# EAGLE design Laser7Clock (EAGLE 9.2.2)
COMPANY: UnexpectedMaker; DATE: Jan 14 2019; DRAWN: Seon; REV: 4; TITLE: LaserWifiClock

## Sheet 1 of 2
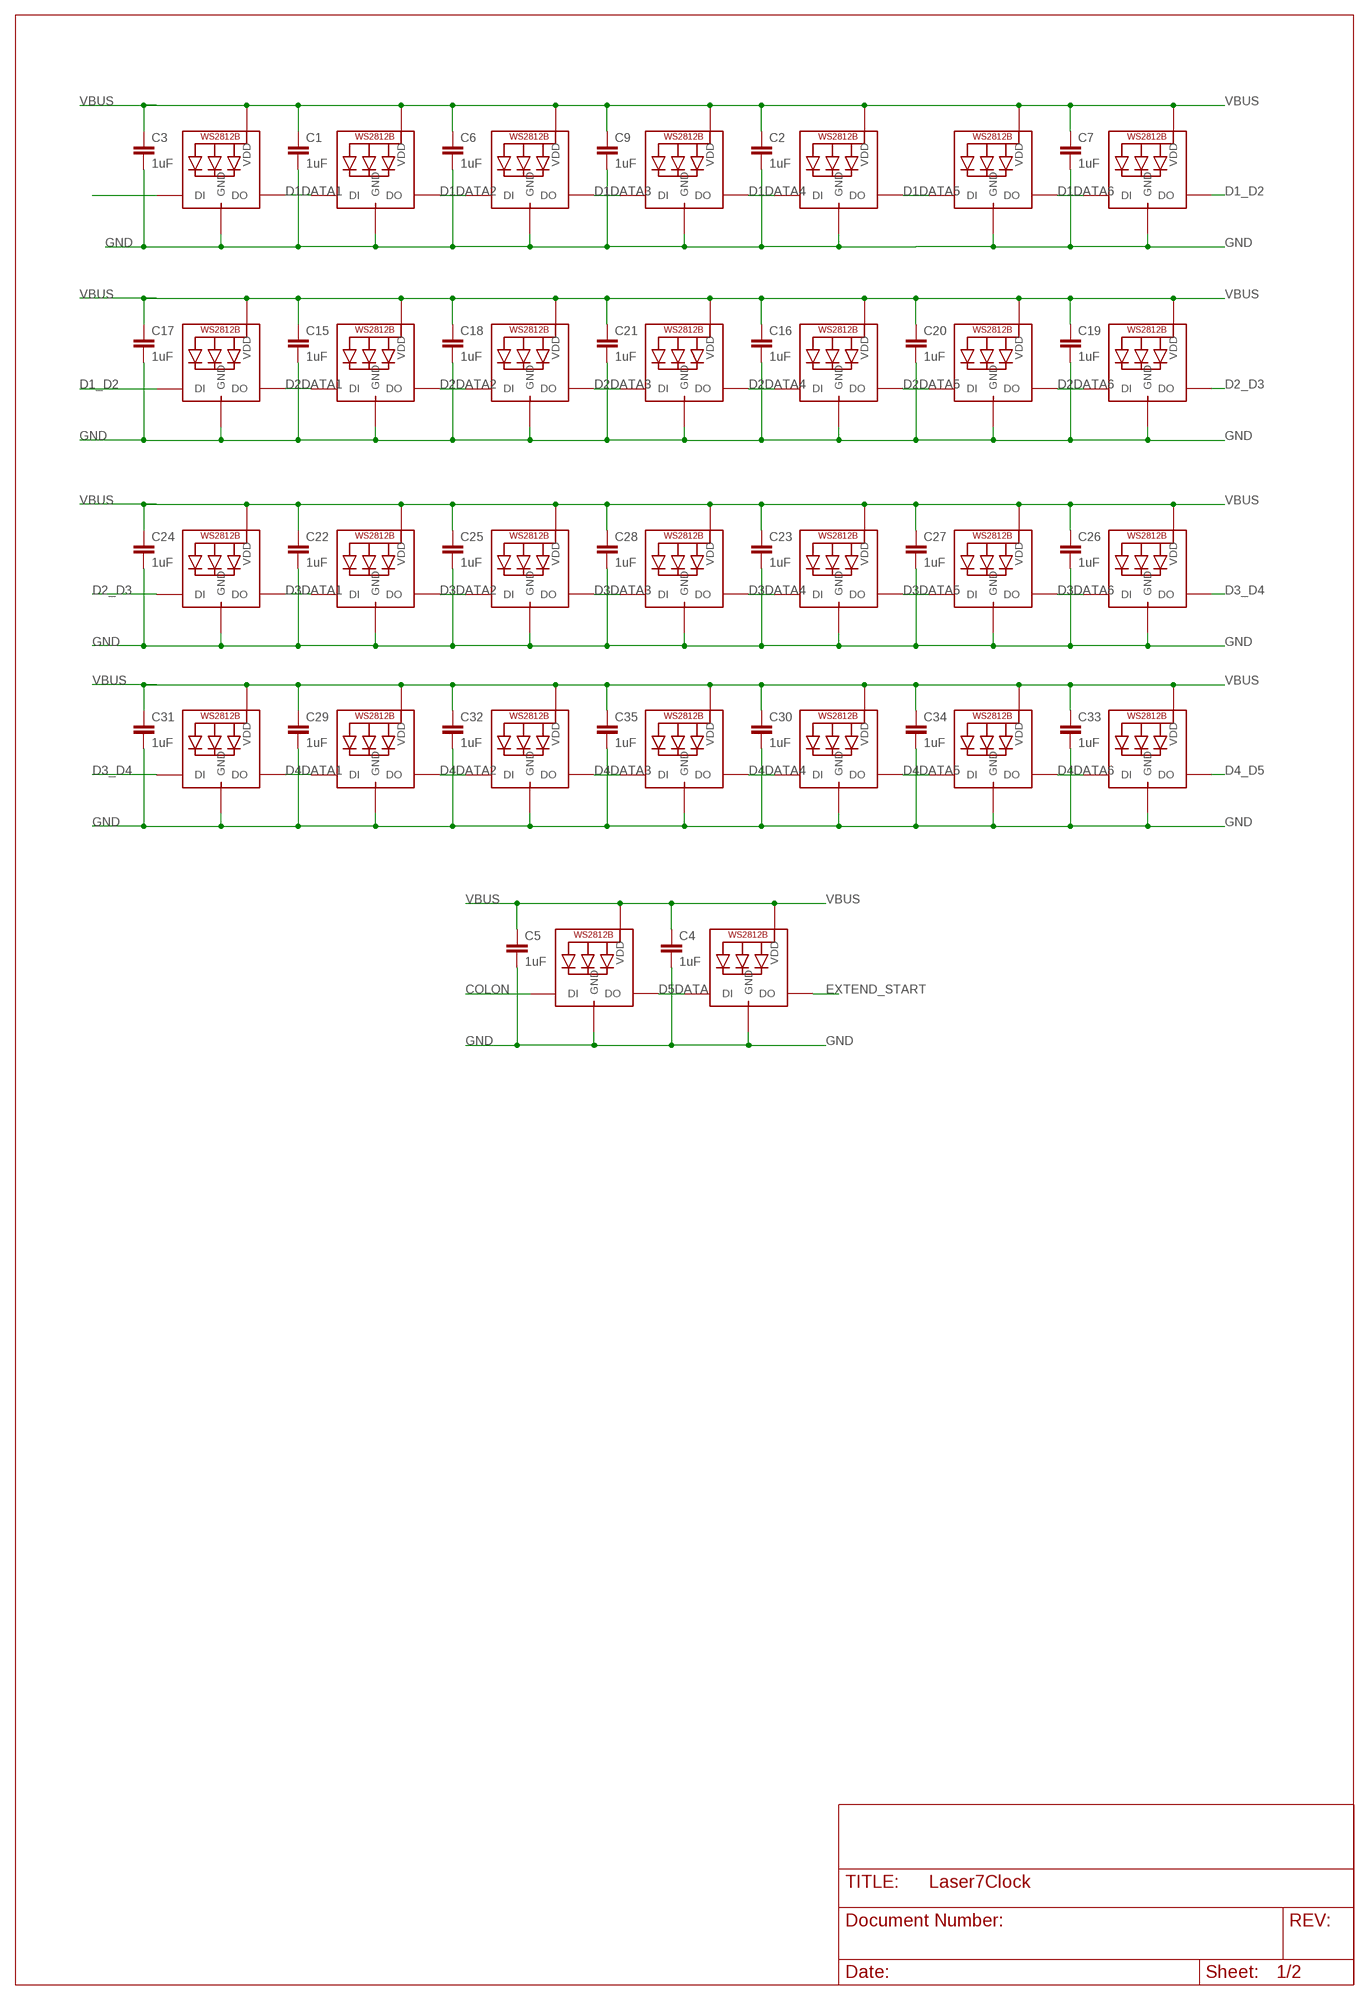
[diagram p0: schematic, sheet 1]

### Parts
C1  1uF  C-EUC0805K  [C0805K]
C2  1uF  C-EUC0805K  [C0805K]
C3  1uF  C-EUC0805K  [C0805K]
C4  1uF  C-EUC0805K  [C0805K]
C5  1uF  C-EUC0805K  [C0805K]
C6  1uF  C-EUC0805K  [C0805K]
C7  1uF  C-EUC0805K  [C0805K]
C9  1uF  C-EUC0805K  [C0805K]
C15  1uF  C-EUC0805K  [C0805K]
C16  1uF  C-EUC0805K  [C0805K]
C17  1uF  C-EUC0805K  [C0805K]
C18  1uF  C-EUC0805K  [C0805K]
C19  1uF  C-EUC0805K  [C0805K]
C20  1uF  C-EUC0805K  [C0805K]
C21  1uF  C-EUC0805K  [C0805K]
C22  1uF  C-EUC0805K  [C0805K]
C23  1uF  C-EUC0805K  [C0805K]
C24  1uF  C-EUC0805K  [C0805K]
C25  1uF  C-EUC0805K  [C0805K]
C26  1uF  C-EUC0805K  [C0805K]
C27  1uF  C-EUC0805K  [C0805K]
C28  1uF  C-EUC0805K  [C0805K]
C29  1uF  C-EUC0805K  [C0805K]
C30  1uF  C-EUC0805K  [C0805K]
C31  1uF  C-EUC0805K  [C0805K]
C32  1uF  C-EUC0805K  [C0805K]
C33  1uF  C-EUC0805K  [C0805K]
C34  1uF  C-EUC0805K  [C0805K]
C35  1uF  C-EUC0805K  [C0805K]
D1L1  WS2812B5050  [WS2812B]
D1L2  WS2812B5050  [WS2812B]
D1L3  WS2812B5050  [WS2812B]
D1L4  WS2812B5050  [WS2812B]
D1L5  WS2812B5050  [WS2812B]
D1L6  WS2812B5050  [WS2812B]
D1L7  WS2812B5050  [WS2812B]
D2L1  WS2812B5050  [WS2812B]
D2L2  WS2812B5050  [WS2812B]
D2L3  WS2812B5050  [WS2812B]
D2L4  WS2812B5050  [WS2812B]
D2L5  WS2812B5050  [WS2812B]
D2L6  WS2812B5050  [WS2812B]
D2L7  WS2812B5050  [WS2812B]
D3L1  WS2812B5050  [WS2812B]
D3L2  WS2812B5050  [WS2812B]
D3L3  WS2812B5050  [WS2812B]
D3L4  WS2812B5050  [WS2812B]
D3L5  WS2812B5050  [WS2812B]
D3L6  WS2812B5050  [WS2812B]
D3L7  WS2812B5050  [WS2812B]
D4L1  WS2812B5050  [WS2812B]
D4L2  WS2812B5050  [WS2812B]
D4L3  WS2812B5050  [WS2812B]
D4L4  WS2812B5050  [WS2812B]
D4L5  WS2812B5050  [WS2812B]
D4L6  WS2812B5050  [WS2812B]
D4L7  WS2812B5050  [WS2812B]
LED1  WS2812B5050  [WS2812B]
LED2  WS2812B5050  [WS2812B]

### Nets
COLON: LED1.4-DIN(DI) ; also sheet 2
D1_D2: D1L7.2-DOUT(DO) D2L1.4-DIN(DI)
D1DATA1: D1L1.2-DOUT(DO) D1L2.4-DIN(DI)
D1DATA2: D1L2.2-DOUT(DO) D1L3.4-DIN(DI)
D1DATA3: D1L3.2-DOUT(DO) D1L4.4-DIN(DI)
D1DATA4: D1L4.2-DOUT(DO) D1L5.4-DIN(DI)
D1DATA5: D1L5.2-DOUT(DO) D1L6.4-DIN(DI)
D1DATA6: D1L6.2-DOUT(DO) D1L7.4-DIN(DI)
D2_D3: D2L7.2-DOUT(DO) D3L1.4-DIN(DI)
D2DATA1: D2L1.2-DOUT(DO) D2L2.4-DIN(DI)
D2DATA2: D2L2.2-DOUT(DO) D2L3.4-DIN(DI)
D2DATA3: D2L3.2-DOUT(DO) D2L4.4-DIN(DI)
D2DATA4: D2L4.2-DOUT(DO) D2L5.4-DIN(DI)
D2DATA5: D2L5.2-DOUT(DO) D2L6.4-DIN(DI)
D2DATA6: D2L6.2-DOUT(DO) D2L7.4-DIN(DI)
D3_D4: D3L7.2-DOUT(DO) D4L1.4-DIN(DI)
D3DATA1: D3L1.2-DOUT(DO) D3L2.4-DIN(DI)
D3DATA2: D3L2.2-DOUT(DO) D3L3.4-DIN(DI)
D3DATA3: D3L3.2-DOUT(DO) D3L4.4-DIN(DI)
D3DATA4: D3L4.2-DOUT(DO) D3L5.4-DIN(DI)
D3DATA5: D3L5.2-DOUT(DO) D3L6.4-DIN(DI)
D3DATA6: D3L6.2-DOUT(DO) D3L7.4-DIN(DI)
D4_D5: D4L7.2-DOUT(DO) ; also sheet 2
D4DATA1: D4L1.2-DOUT(DO) D4L2.4-DIN(DI)
D4DATA2: D4L2.2-DOUT(DO) D4L3.4-DIN(DI)
D4DATA3: D4L3.2-DOUT(DO) D4L4.4-DIN(DI)
D4DATA4: D4L4.2-DOUT(DO) D4L5.4-DIN(DI)
D4DATA5: D4L5.2-DOUT(DO) D4L6.4-DIN(DI)
D4DATA6: D4L6.2-DOUT(DO) D4L7.4-DIN(DI)
D5DATA: LED1.2-DOUT(DO) LED2.4-DIN(DI)
DI_R: D1L1.4-DIN(DI) ; also sheet 2
EXTEND_START: LED2.2-DOUT(DO) ; also sheet 2
GND: C1.2 C2.2 C3.2 C4.2 C5.2 C6.2 C7.2 C9.2 C15.2 C16.2 C17.2 C18.2 C19.2 C20.2 C21.2 C22.2 C23.2 C24.2 C25.2 C26.2 C27.2 C28.2 C29.2 C30.2 C31.2 C32.2 C33.2 C34.2 C35.2 D1L1.3-GND(GND) D1L2.3-GND(GND) D1L3.3-GND(GND) D1L4.3-GND(GND) D1L5.3-GND(GND) D1L6.3-GND(GND) D1L7.3-GND(GND) D2L1.3-GND(GND) D2L2.3-GND(GND) D2L3.3-GND(GND) D2L4.3-GND(GND) D2L5.3-GND(GND) D2L6.3-GND(GND) D2L7.3-GND(GND) D3L1.3-GND(GND) D3L2.3-GND(GND) D3L3.3-GND(GND) D3L4.3-GND(GND) D3L5.3-GND(GND) D3L6.3-GND(GND) D3L7.3-GND(GND) D4L1.3-GND(GND) D4L2.3-GND(GND) D4L3.3-GND(GND) D4L4.3-GND(GND) D4L5.3-GND(GND) D4L6.3-GND(GND) D4L7.3-GND(GND) LED1.3-GND(GND) LED2.3-GND(GND) ; also sheet 2
VBUS: C1.1 C2.1 C3.1 C4.1 C5.1 C6.1 C7.1 C9.1 C15.1 C16.1 C17.1 C18.1 C19.1 C20.1 C21.1 C22.1 C23.1 C24.1 C25.1 C26.1 C27.1 C28.1 C29.1 C30.1 C31.1 C32.1 C33.1 C34.1 C35.1 D1L1.1-VDD(VDD) D1L2.1-VDD(VDD) D1L3.1-VDD(VDD) D1L4.1-VDD(VDD) D1L5.1-VDD(VDD) D1L6.1-VDD(VDD) D1L7.1-VDD(VDD) D2L1.1-VDD(VDD) D2L2.1-VDD(VDD) D2L3.1-VDD(VDD) D2L4.1-VDD(VDD) D2L5.1-VDD(VDD) D2L6.1-VDD(VDD) D2L7.1-VDD(VDD) D3L1.1-VDD(VDD) D3L2.1-VDD(VDD) D3L3.1-VDD(VDD) D3L4.1-VDD(VDD) D3L5.1-VDD(VDD) D3L6.1-VDD(VDD) D3L7.1-VDD(VDD) D4L1.1-VDD(VDD) D4L2.1-VDD(VDD) D4L3.1-VDD(VDD) D4L4.1-VDD(VDD) D4L5.1-VDD(VDD) D4L6.1-VDD(VDD) D4L7.1-VDD(VDD) LED1.1-VDD(VDD) LED2.1-VDD(VDD) ; also sheet 2

## Sheet 2 of 2
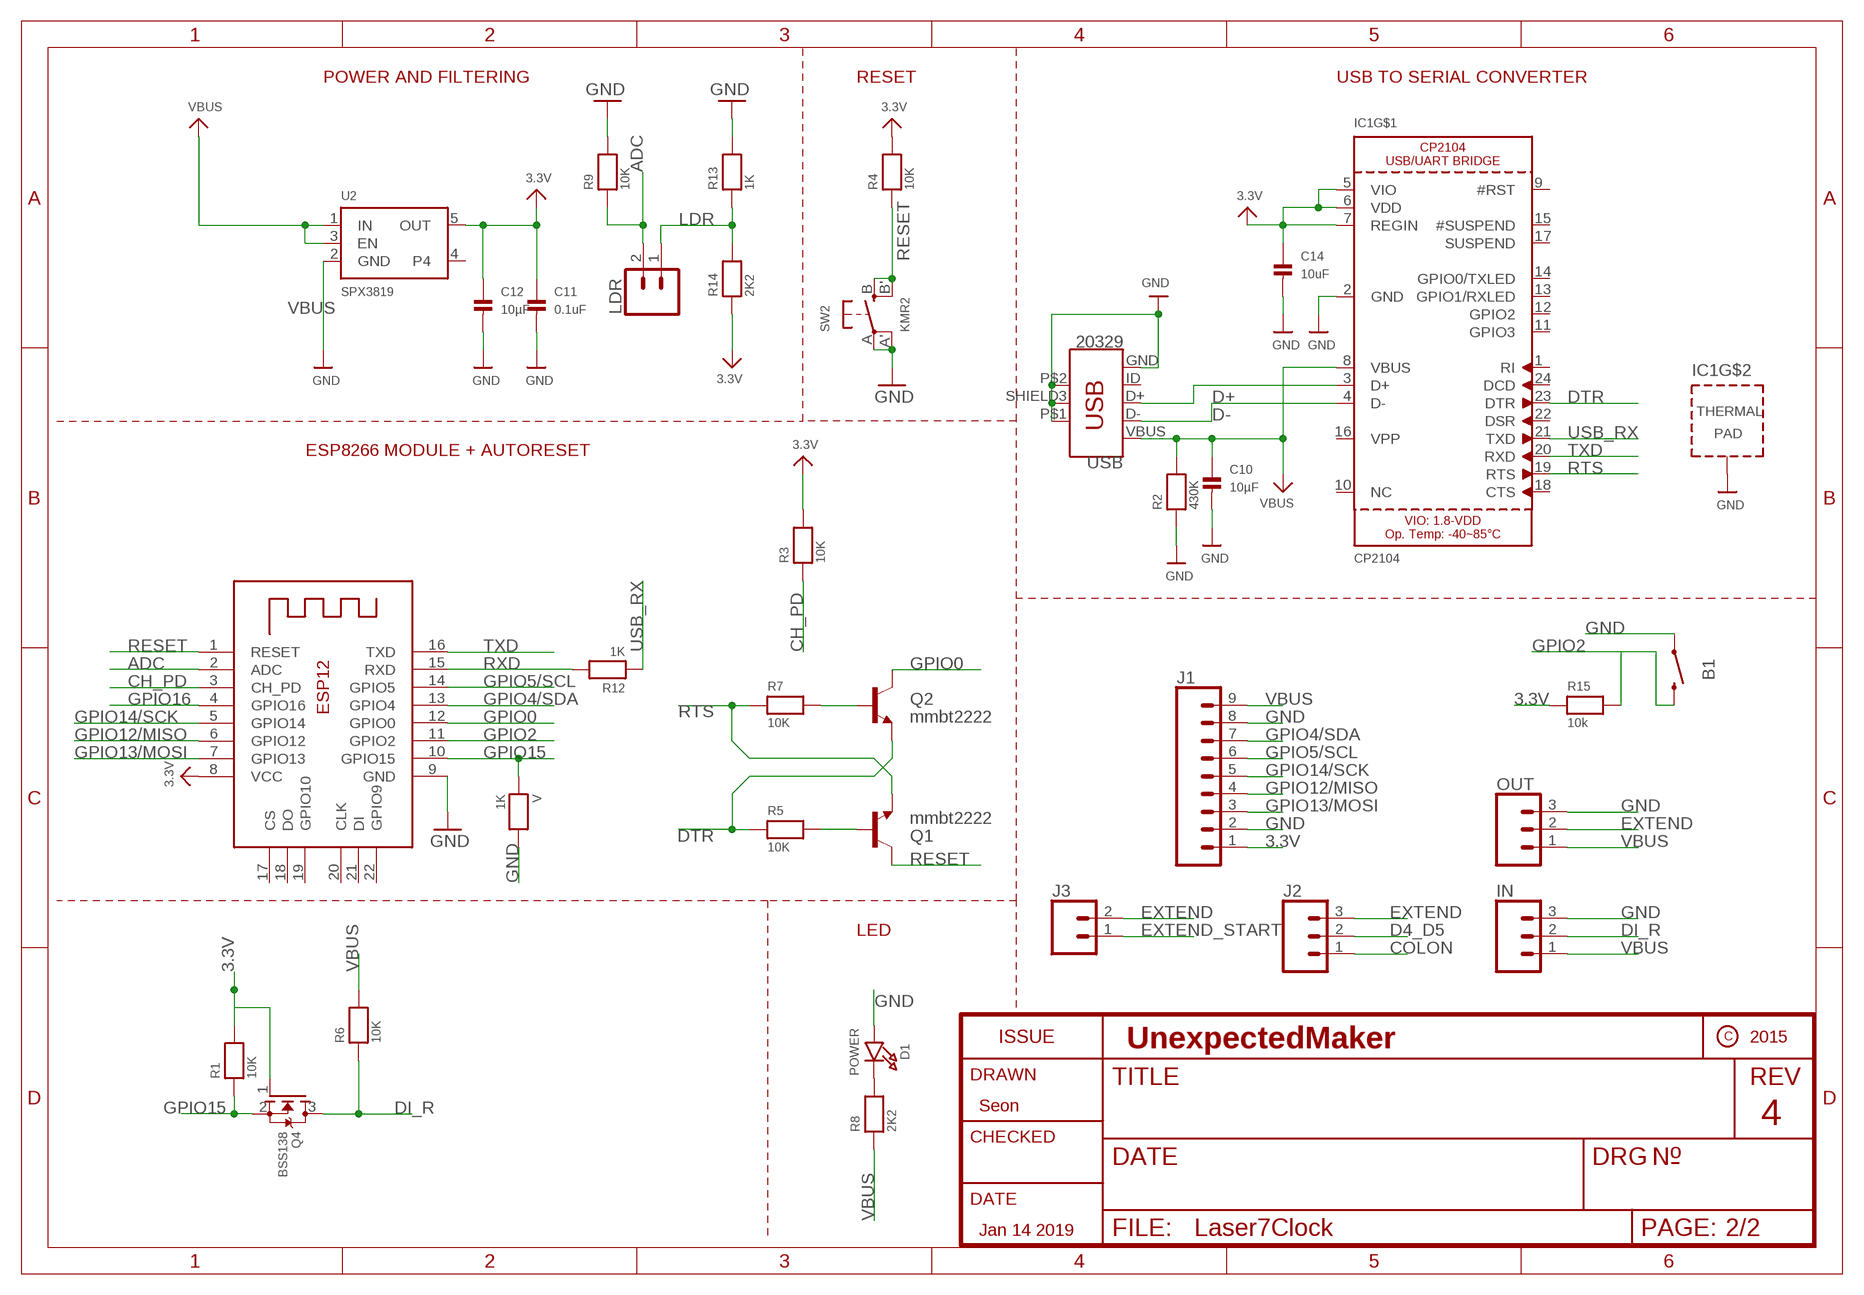
[diagram p1: schematic, sheet 2]

### Parts
B1  MOMENTARY-SWITCH-SPST-PTH-RIGHT-ANGLE-KIT  [TACTILE_SWITCH_PTH_RIGHT_ANGLE_KIT]
C10  10µF  CAP_CERAMIC_0805MP  [_0805MP]
C11  0.1uF  CAP_CERAMIC_0805MP  [_0805MP]
C12  10µF  CAP_CERAMIC_0805MP  [_0805MP]
C14  10uF  CAP_CERAMIC_0805MP  [_0805MP]
D1  POWER  LED0805_NOOUTLINE  [CHIPLED_0805_NOOUTLINE]
IC1  CP2104  [QFN24_4MM_SMSC]
IN  CONN_03LONGPADS  [1X03_LONGPADS]
J1  CONN_09NO_SILK  [1X09_NO_SILK]
J2  CONN_031X03_NO_SILK  [1X03_NO_SILK]
J3  CONN_021X02_NO_SILK  [1X02_NO_SILK]
LDR  CONN_021X02_NO_SILK  [1X02_NO_SILK]
OUT  CONN_03LONGPADS  [1X03_LONGPADS]
Q1  mmbt2222  TRANSISTOR_NPNSOT23-3  [SOT23-3]
Q2  mmbt2222  TRANSISTOR_NPNSOT23-3  [SOT23-3]
Q4  BSS138  MOSFET-NREFLOW  [SOT23-R]
R1  10K  RESISTOR_0603MP  [_0603MP]
R2  430K  RESISTOR_0805MP  [_0805MP]
R3  10K  RESISTOR_0603MP  [_0603MP]
R4  10K  RESISTOR_0603MP  [_0603MP]
R5  10K  RESISTOR_0603MP  [_0603MP]
R6  10K  RESISTOR_0603MP  [_0603MP]
R7  10K  RESISTOR_0603MP  [_0603MP]
R8  2K2  RESISTOR_0805MP  [_0805MP]
R9  10K  RESISTOR_0805MP  [_0805MP]
R12  1K  RESISTOR_0603MP  [_0603MP]
R13  1K  RESISTOR_0805MP  [_0805MP]
R14  2K2  RESISTOR_0805MP  [_0805MP]
R15  10k  RESISTOR_0603MP  [_0603MP]
SW2  KMR2  SWITCH_TACT_SMT4.6X2.8  [BTN_KMR2_4.6X2.8]
U2  SPX3819  VREG_SOT23-5  [SOT23-5]
USB  20329  TINYPICO_USB_FEMALE-SMT  [USB-B-MICRO-SMD]
V  1K  RESISTOR_0603MP  [_0603MP]
X2  ESP-12  ESP-12E  [ESP-12E]

### Nets
3.3V: C11.1 C12.1 C14.1 IC1.5(VIO) IC1.6(VDD) IC1.7(REGIN) J1.1 Q4.1(G) R1.2 R3.2 R4.2 R14.1 R15.1 U2.5(OUT) X2.8(VCC)
ADC: LDR.2 R9.1 X2.2(ADC)
CH_PD: R3.1 X2.3(CH_PD)
COLON: J2.1 ; also sheet 1
D4_D5: J2.2 ; also sheet 1
D+: IC1.3(D+) USB.D+
D-: IC1.4(D-) USB.D-
DI_R: IN.2 Q4.3(D) R6.1 ; also sheet 1
DTR: IC1.23(DTR) Q2.2(E) R5.1
EXTEND: J2.3 J3.2 OUT.2
EXTEND_START: J3.1 ; also sheet 1
GND: B1.1 C10.2 C11.2 C12.2 C14.2 D1.A IC1.2(GND) IC1.THERM(TP) IN.3 J1.2 J1.8 OUT.3 R2.1 R9.2 R13.2 SW2.A'(P1) SW2.A(P) U2.2(GND) USB.GND USB.P$1(SHIELD1) USB.P$2(SHIELD2) USB.SHIELD3(SHIELD) V.2 X2.9(GND) ; also sheet 1
GPIO0: Q2.3(C) X2.12(GPIO0)
GPIO2: B1.2 R15.2 X2.11(GPIO2)
GPIO4/SDA: J1.7 X2.13(GPIO4)
GPIO5/SCL: J1.6 X2.14(GPIO5)
GPIO12/MISO: J1.4 X2.6(GPIO12)
GPIO13/MOSI: J1.3 X2.7(GPIO13)
GPIO14/SCK: J1.5 X2.5(GPIO14)
GPIO15: Q4.2(S) R1.1 V.1 X2.10(GPIO15)
GPIO16: X2.4(GPIO16)
LDR: LDR.1 R13.1 R14.2
N$2: D1.C R8.2
N$12: Q1.1(B) R5.2
N$13: Q2.1(B) R7.2
RESET: Q1.3(C) R4.1 SW2.B'(S1) SW2.B(S) X2.1(RESET)
RTS: IC1.19(RTS) Q1.2(E) R7.1
RXD: R12.2 X2.15(RXD)
TXD: IC1.20(RXD) X2.16(TXD)
USB_RX: IC1.21(TXD) R12.1
VBUS: C10.1 IC1.8(VBUS) IN.1 J1.9 OUT.1 R2.2 R6.2 R8.1 U2.1(IN) U2.3(EN) USB.VBUS ; also sheet 1
Unconnected: IC1.1(RI) IC1.9(#RST) IC1.10(NC) IC1.11(GPIO3) IC1.12(GPIO2) IC1.13(GPIO1/RXLED) IC1.14(GPIO0/TXLED) IC1.15(#SUSPEND) IC1.16(VPP) IC1.17(SUSPEND) IC1.18(CTS) IC1.22(DSR) IC1.24(DCD) U2.4 USB.ID X2.17(CS) X2.18(DO) X2.19(GPIO10) X2.20(CLK) X2.21(DI) X2.22(GPIO9)

### Notes on the sheet
- POWER AND FILTERING | RESET | USB TO SERIAL CONVERTER
- ESP8266 MODULE + AUTORESET
- LED

## Library data of the parts
B1 = SparkFun-Switches:MOMENTARY-SWITCH-SPST: Momentary Switch (Pushbutton) - SPST Normally-open (NO) SPST momentary switches (buttons, pushbuttons). Variants PTH-12MM - 12mm square, through-hole Momentary Pushbutton Switch - 12mm Square <https://www.sparkfun.com/products/9190> (COM-09190) PTH-6.0MM, PTH-6.0MM-KIT - 6.0mm square, through-hole Mini Pushbutton Switch <https://www.sparkfun.com/products/97> (COM-00097) KIT package intended for soldering kit's - only one side of pads' copper is exposed. PTH-RIGHT-ANGLE-KIT - Right-angle, through-hole Right Angle Tactile Button <https://www.sparkfun.com/products/10791> - Used on SparkFun BigTime Watch Kit <https://www.sparkfun.com/products/11734> SMD-12MM - 12mm square, surface-mount Tactile Button - SMD (12mm) <https://www.sparkfun.com/products/12993> (COM-12993) Used on SparkFun PicoBoard <https://www.sparkfun.com/products/11888> SMD-4.5MM - 4.5mm Square Trackball Switch Used on SparkFun Blackberry Trackballer Breakout <https://www.sparkfun.com/products/13169> SMD-4.6MMX2.8MM - 4.60mm x 2.80mm, surface mount Used on SparkFun SAMD21 Mini Breakout <https://www.sparkfun.com/products/13664> SMD-5.2MM, SMD-5.2-REDUNDANT - 5.2mm square, surface-mount Mini Pushbutton Switch - SMD <https://www.sparkfun.com/products/8720> (COM-08720) Used on Arduino Pro Mini <https://www.sparkfun.com/products/11114> REDUNDANT package connects both switch circuits together SMD-6.0X3.5MM - 6.0 x 3.5mm, surface mount Momentary Reset Switch SMD <https://www.sparkfun.com/products/8229> (COM-08229) SMD-6.2MM-TALL - 6.2mm square, surface mount Tactile Button - SMD (6mm) <https://www.sparkfun.com/products/12992> Used on SparkFun Digital Sandbox <https://www.sparkfun.com/products/12651> SMD-RIGHT-ANGLE - Right-angle, surface mount Used on SparkFun Block for Intel® Edison - Arduino <https://www.sparkfun.com/products/13036>; PROD_ID: CONN-10672; SF_SKU: COM-10791
C1-C7 C9 C15-C35 = rcl:C-EU: CAPACITOR, European symbol
C10-C12 C14 = microbuilder:CAP_CERAMIC: Ceramic Capacitors 0402 - 0402 Surface Mount Capacitors 16pF 50V 5% [Digikey: 445-4899-2-ND] 18pF 50V 5% [Digikey: 490-1281-2-ND] 22pF 50V 5% [Digikey: 490-1283-2-ND] 68pF 50V 5% [Digikey: 490-1289-2-ND] 0.1uF 10V 10% [Digikey: 490-1318-2-ND] 1.0uF 6.3V 10% [Digikey: 490-1320-2-ND] 0603 - 0603 Surface Mount Capacitors 16 pF 50V 5% [Digikey: 445-5051-2-ND] 22 pF 50V [Digikey: PCC220ACVTR-ND] 33 pF 50V 5% [Digikey: 490-1415-1-ND] 56pF 50V 5% [Digikey: 490-1421-1-ND] 220pF 50V 5% [Digikey: 445-1285-1-ND] 680 pF 50V 2200 pF 50V 5% C0G [Digikey: 445-1297-1-ND] 5600 pF 100V 5% X7R [Digikey: 478-3711-1-ND] 0.1 µF 25V 10% [Digikey: PCC2277TR-ND] 0.22 µF 16V 10% X7R [Digikey: 445-1318-1-ND] 1.0 µF 25V 10% [Digikey: 445-5146-2-ND] 0603 - RF Specific 3pF 250V +/-0.1pF RF [Digikey: 712-1347-1-ND] 18 pF 250V 5% [Digikey: 478-3505-1-ND or 712-1322-1-ND] 56 pF 250V 5% C0G RF [Digikey: 490-4867-1-ND] 68 pF 250V RF [Digikey: 490-4868-1-ND] 0805 - 0805 Surface Mount Capacitors 220 pF 250V 2% RF Ceramic Capacitor [Digikey: 712-1398-1-ND] 1000 pF 50V 2% NP0 Ceramic Capacitor [Digikey: 478-3760-1-ND] 0.1 µF 25V 10% Ceramic Capacitor [Digikey: PCC1828TR-ND] 1.0 µF 16V 10% Ceramic Capacitor[Digikey: 490-1691-2-ND] 10.0 µF 10V 10% Ceramic Capacitor[Digikey: 709-1228-1-ND] 10.0 uF 16V 10% Ceramic Capacitor [Digikey: 478-5165-2-ND] 47 uF 6.3V 20% Ceramic Capacitor [Digikey: 587-1779-1-ND or 399-5506-1-ND] 1206 - 1206 Surface Mount Capacitors 47uF 10V 20% Ceramic Capacitor [Digikey: 490-5528-1-ND or 399-5508-1-ND or 445-6010-1-ND] 100uF 6.3V -20%, +80% Y5V Ceramic Capacitor (Digikey: 490-4512-1-ND, Mouser: 81-GRM31CF50J107ZE1L)
D1 = microbuilder:LED: LED 0603 - 0603 Surface Mount Package 2mA: Green LED - Low Power (3.9mcd, 2ma, 1.7Vf) - Digikey: 475-2709-2-ND Orange LED - Low Power (9.8mcd, 2ma, 1.8Vf) - Digikey: 475-1194-2-ND Red LED - Low Power (5mcd, 2ma, 1.8Vf) - Digikey: 475-1195-2-ND Yellow LED - Low Power (7mcd, 2ma, 1.8Vf) - Digikey: 475-1196-2-ND 5mA: Blue LED - Low Power (17mcd, 5ma, 2.9Vf) - Digikey: LNJ937W8CRACT-ND 0805 - 0805 Surface Mount Package 2mA: Red LED (8.8mcd, 2mA, 1.8Vf, Clear) - Low Power [Digikey: 475-2510-1-ND] Green LED (5mcd, 2mA, 1.8Vf, Clear) - Low Power [Digikey: 475-2730-1-ND] Yellow LED (11.3mcd, 2mA, 1.8Vf, Clear) - Low Power [Digikey: 475-2555-1-ND] 20mA: Red LED (104mcd, 20mA, Diffused) - LS R976 [Digikey: 475-1278-6-ND] Red LED (12mcd, 20mA, 2.0Vf, Clear) - APT2012EC [Digikey: 754-1128-1-ND] Green LED (15mcd, 20mA, 2.2Vf, Clear) - APT2012GC [Digikey: 754-1131-1-ND] Orange LED (160mcd, 20mA, 2.1Vf, Clear) - APT2012SECK [Digikey: 754-1130-1-ND] 1206 - 1206 Surface Mount Package Green LED (26mcd, 20mA, Diffused) - LG N971 [Digikey: 475-1407-6-ND] Red LED (15mcd, 20mA, Diffused) - LH N974 [Digikey: 475-1416-6-ND] Cree - Cree High-Power Surface Mount LEDs XPEBWT-L1-0000-00D50 - White 111lm 350mA 2.9Vf 6200K 110° XTEAWT-00-0000-00000LEE3 - White 114lm 350mA 2.85Vf 5000K 115° Everlight - Everlight 45-21 Series Surface Mount LEDs 45-21/QK2C-B2832AC2CB2/2T - Warm White 2000mcd 20mA 3.25Vf 3050K 120° 45-21/LK2C-B38452C4CB2/2T - Nuetral White 2000mcd 20mA 3.25Vf 4150K 120° 45-21/LK2C-B50634C6CB2/2T - Cold White 2200mcd 20mA 3.25Vf 5650K 120° PLCC2 Reverse Mount LS T77K-J1L2-1-0-2-R18-Z - Red 11.25mcd 2mA 1.8Vf 630nm 120° LO T77K-L1M2-24-Z - Orange 19.6mcd 2mA 1.8Vf 606nm 120° LY T77K-K2M1-26-Z - Yellow 15.7mcd 2mA 1.8Vf 587nm 120°
D1L1-D1L7 D2L1-D2L7 D3L1-D3L7 D4L1-D4L7 LED1 LED2 = adafruit:WS2812B
IC1 = microbuilder:CP2104: CP2104 - USB to UART Bridge VDD Output: 3.45V
IN J2 OUT = SparkFun-Connectors:CONN_03: Multi connection point. Often used as Generic Header-pin footprint for 0.1 inch spaced/style header connections On any of the 0.1 inch spaced packages, you can populate with these: Break Away Headers - Straight <https://www.sparkfun.com/products/116> (PRT-00116) Break Away Male Headers - Right Angle <https://www.sparkfun.com/products/553> (PRT-00553) Female Headers <https://www.sparkfun.com/products/115> (PRT-00115) Break Away Headers - Machine Pin <https://www.sparkfun.com/products/117> (PRT-00117) Break Away Female Headers - Swiss Machine Pin <https://www.sparkfun.com/products/743> (PRT-00743) Stackable Header - 3 Pin (Female, 0.1") <https://www.sparkfun.com/products/13875> (PRT-13875) For SCREWTERMINALS and SPRING TERMINALS visit here: Screw Terimnals on SparkFun.com <https://www.sparkfun.com/search/results?term=Screw+Terminals> (5mm/3.5mm/2.54mm spacing) This device is also useful as a general connection point to wire up your design to another part of your project. Our various solder wires solder well into these plated through hole pads. Hook-Up Wire - Assortment (Stranded, 22 AWG) <https://www.sparkfun.com/products/11375> (PRT-11375) Hook-Up Wire - Assortment (Solid Core, 22 AWG) <https://www.sparkfun.com/products/11367> (PRT-11367) View the entire wire category on our website here <https://www.sparkfun.com/categories/141> Special notes: Molex polarized connector foot print use with SKU : PRT-08232 with associated crimp pins and housings.
J1 = SparkFun-Connectors:CONN_09: Multi connection point. Often used as Generic Header-pin footprint for 0.1 inch spaced/style header connections On any of the 0.1 inch spaced packages, you can populate with these: Break Away Headers - Straight <https://www.sparkfun.com/products/116> (PRT-00116) Break Away Male Headers - Right Angle <https://www.sparkfun.com/products/553> (PRT-00553) Female Headers <https://www.sparkfun.com/products/115> (PRT-00115) Break Away Headers - Machine Pin <https://www.sparkfun.com/products/117> (PRT-00117) Break Away Female Headers - Swiss Machine Pin <https://www.sparkfun.com/products/743> (PRT-00743) For SCREWTERMINALS and SPRING TERMINALS visit here: Screw Terimnals on SparkFun.com <https://www.sparkfun.com/search/results?term=Screw+Terminals> (5mm/3.5mm/2.54mm spacing) This device is also useful as a general connection point to wire up your design to another part of your project. Our various solder wires solder well into these plated through hole pads. Hook-Up Wire - Assortment (Stranded, 22 AWG) <https://www.sparkfun.com/products/11375> (PRT-11375) Hook-Up Wire - Assortment (Solid Core, 22 AWG) <https://www.sparkfun.com/products/11367> (PRT-11367) View the entire wire category on our website here <https://www.sparkfun.com/categories/141> Special notes: Molex polarized connector foot print use with SKU : PRT-08231 with associated crimp pins and housings. 1MM SMD Version SKU: PRT-10208 NOTES ON THE VARIANTS LOCK and LOCK_LONGPADS... This footprint was designed to help hold the alignment of a through-hole component (i.e. 6-pin header) while soldering it into place. You may notice that each hole has been shifted either up or down by 0.005 of an inch from it's more standard position (which is a perfectly straight line). This slight alteration caused the pins (the squares in the middle) to touch the edges of the holes. Because they are alternating, it causes a "brace" to hold the component in place. 0.005 has proven to be the perfect amount of "off-center" position when using our standard breakaway headers. Although looks a little odd when you look at the bare footprint, once you have a header in there, the alteration is very hard to notice. Also,if you push a header all the way into place, it is covered up entirely on the bottom side.
J3 LDR = SparkFun-Connectors:CONN_02: Multi connection point. Often used as Generic Header-pin footprint for 0.1 inch spaced/style header connections On any of the 0.1 inch spaced packages, you can populate with these: Break Away Headers - Straight <https://www.sparkfun.com/products/116> (PRT-00116) Break Away Male Headers - Right Angle <https://www.sparkfun.com/products/553> (PRT-00553) Female Headers <https://www.sparkfun.com/products/115> (PRT-00115) Break Away Headers - Machine Pin <https://www.sparkfun.com/products/117> (PRT-00117) Break Away Female Headers - Swiss Machine Pin <https://www.sparkfun.com/products/743> (PRT-00743) For SCREWTERMINALS and SPRING TERMINALS visit here: Screw Terimnals on SparkFun.com <https://www.sparkfun.com/search/results?term=Screw+Terminals> (5mm/3.5mm/2.54mm spacing) This device is also useful as a general connection point to wire up your design to another part of your project. Our various solder wires solder well into these plated through hole pads. Hook-Up Wire - Assortment (Stranded, 22 AWG) <https://www.sparkfun.com/products/11375> (PRT-11375) Hook-Up Wire - Assortment (Solid Core, 22 AWG) <https://www.sparkfun.com/products/11367> (PRT-11367) View the entire wire category on our website here <https://www.sparkfun.com/categories/141> Special notes: Molex polarized connector foot print use with: PRT-08233 with associated crimp pins and housings. 2.54_SCREWTERM for use with PRT-10571. 3.5mm Screw Terminal footprints for PRT-08084 5mm Screw Terminal footprints for use with PRT-08432
Q1 Q2 = SparkFun:TRANSISTOR_NPN: Transistor NPN BJT configuration in SOT23 package. MMBT2222 is the common NPN we use. Double check BCE configuration again layout.
Q4 = microbuilder:MOSFET-N: N-Channel Mosfet LEGEND VDS: Voltage Drain-Source ID: Drain Current RDS(ON): Drain-Source On-State Resistance VGS(TH): Gate-Source Threshold Voltage CISS: Drain-Source Input Capacitance SOT-23 Name VDS ID RDS(ON) VGS(TH) CISS Order Number 2N7002E 60V 260mA 2.5 Ohm 2.5V @ 250uA 26.7pF @ 25V 2N7002ET1GOSTR-ND BSH103 30V 850mA 400 mOhm 400mV @ 1mA 83pF @ 24V BSH103,235-ND BSS138 60V 320mA 1.6 Ohm 1.5V @ 250uA 50pF @ 10V Mouser: 771-BSS138PW115 DMN2075U-7 20V 4.2A 38 mOhm 1V @ 250 uA 594.3pF @ 10V DMN2075U-7DICT-ND * BSS138 good choice for I2C level-shifting
R1-R9 R12-R15 V = microbuilder:RESISTOR: Resistors 0402 - 0402 Surface Mount Package 22 Ohm 1% 1/16W [Digikey: 311-22.0LRTR-ND] 33 Ohm 5% 1/16W 1.0K 5% 1/16W 1.5K 5% 1/16W 2.0K 1% 1/16W 10.0K 1% 1/16W [Digikey: 311-10.0KLRTR-ND] 10.0K 5% 1/16W [Digikey: RMCF0402JT10K0TR-ND] 12.1K 1% 1/16W [Digikey: 311-22.0LRTR-ND] 100.0K 5% 1/16W 0603 - 0603 Surface Mount Package 0 Ohm 1/10 Watt 1% Resistor 15 Ohm 1/10 Watt 1% Resistor 33 Ohm 1/10 Watt 1% Resistor 49.9 Ohm 1/10 Watt 1% Resistor 100 Ohm 1/10 Watt 1% Resistor 150 Ohm 1/10 Watt 1% Resistor 240 Ohm 1/10 Watt 1% Resistor 390 Ohm 1/10 Watt 1% Resistor 560 Ohm 1/10 Watt 1% Resistor 680 Ohm 1/10 Watt 1% Resistor 750 Ohm 1/10 Watt 1% Resistor 1.0K Ohm 1/10 Watt 1% Resistor 1.5K Ohm 1/10 Watt 1% Resistor 2.0K Ohm 1/10 Watt 1% Resistor 2.2K Ohm 1/10 Watt 1% Resistor 3.3K Ohm 1/10 Watt 1% Resistor 4.7K Ohm 1/10 Watt 1% Resistor 10.0K Ohm 1/10 Watt 1% Resistor 12.0K Ohm 1/10 Watt 1% Resistor 12.1K Ohm 1/10 Watt 1% Resistor 20.0K Ohm 1/10 Watt 1% Resistor 33.0K Ohm 1/10 Watt 1% Resistor 100.0K Ohm 1/10 Watt 1% Resistor 0805 - 0805 Surface Mount Package 0 Ohm 1/8 Watt 1% Resistor 33 Ohm 1/8 Watt 1% Resistor 100 Ohm 1/8 Watt 1% Resistor 150 Ohm 1/8 Watt 1% Resistor 200 Ohm 1/8 Watt 1% Resistor 240 Ohm 1/8 Watt 1% Resistor 330 Ohm 1/8 Watt 1% Resistor 390 Ohm 1/8 Watt 1% Resistor 470 Ohm 1/8 Watt 1% Resistor 1.0K Ohm 1/8 Watt 1% Resistor 1.5K Ohm 1/8 Watt 1% Resistor 2.0K Ohm 1/8 Watt 1% Resistor 4.7K Ohm 1/8 Watt 1% Resistor 5.1K Ohm 1/8 Watt 1% Resistor 5.6K Ohm 1/8 Watt 1% Resistor 10.0K Ohm 1/8 Watt 1% Resistor 22.0K Ohm 1/8 Watt 1% Resistor 33.0K Ohm 1/8 Watt 1% Resistor 100K Ohm 1/8 Watt 1% Resistor 1206 - 1206 Surface Mount Package 2012 - 2010 Surface Mount Package 0.11 Ohm 1/2 Watt 1% Resistor - Digikey: RHM.11UCT-ND
SW2 = microbuilder:SWITCH_TACT_SMT: SMT Tact Switches 6x6mm - Digikey: P12940SCT-ND KMR2 (4.6x2.8mm) - Digikey: 401-1426-1-ND EVQ-PQHB55 - Light Touch, 160GF (4.5x4.5mm) - Digikey: P8090SCT-ND KMT0 - KMT021 NGJ LHS (etc.) IP68/Waterproof - Digikey: CKN10289CT-ND
U2 = microbuilder:VREG_SOT23-5: SOT23-5 Fixed Voltage Regulators Part Current Out V Out V In V Dropout θJA (°C/W) TJ (°C) Digikey Part No. ADP121 150mA 3.3V 3.4-5.5V 0.09V @ 150mA -- -- ADP121-AUJZ33R7CT-ND ADP121 150mA 3.0V 3.1-5.5V 0.09V @ 150mA -- -- ADP121-AUJZ30R7CT-ND ADP122 300mA 3.3V 3.4-5.5V 0.085V @ 300mA -- -- ADP122AUJZ-3.3-R7CT-ND ADP1712 300mA 3.3V 3.5-5.5V 0.17V @ 300mA -- -- ADP1712AUJZ-3.3-R7TR-ND AP7311 (Low Cost) 150mA 3.3V 3.5-6V 0.15V @ 150mA -- -- AP7311-33WG-7DICT-ND LD39015M18R 150mA 1.8V 1.9V-5.5V 0.08V @ 100mA -- -- 497-6977-1-ND LP2985A-33DBVR 150mA 3.3V 3.3-16V 0.28V @ 150mA 206 150 296-18479-1-ND MCP1824T-3302E/OT 300mA 3.3V 3.5V-6V 0.2V @ 300mA -- -- MCP1824T-3302E/OTCT-ND MIC5205-2.5YM5 TR 150mA 2.5V 2.7-16V 0.165V @ 150mA -- -- 576-1257-2-ND MIC5205-3.0YM5 TR 150mA 3.0V 3.2V-16V 0.165V @ 150mA -- -- 576-1258-2-ND MIC5205-3.3YM5 TR 150mA 3.3V 3.5V-16V 0.165V @ 150mA -- -- 576-1259-2-ND TPS780330220 150mA 3.3V+2.2V 3.6-5.5V 250mV Max -- -- 296-23332-1-ND TDA3663/N1,135 100mA 3.3V 3.5-45V 0.18V @ 50mA -- -- 568-5343-1-ND Max operating temp can be calculated using θJA, TJ (max junction temperature), and power in watts. Set the "Maximum Ambient Temperature" until it reaches TJ ("Max Junction Temperature"), which is the absolute limit for safe use of the regulator: Heat Sink Temperature Calculator <http://www.daycounter.com/Calculators/Heat-Sink-Temperature-Calculator.phtml> For example, With 12V source into a 3.3V LP2985 and a 30mA load, we are dissipating (12V-3.3V) * 0.03A = 0.261W. With a θJA of 206 °C/W, a TJ of 150°C, and 261mW we can safely use the chip without a heat sink up to 75°C (=147.1°C Junction Temperature).
USB = UnexpectedMaker:TINYPICO_USB: USB Type Micro-B Connector Male/female and PTH/SMT variants SparkFun Products: SparkFun microB USB Breakout <https://www.sparkfun.com/products/12035> SparkFun USB microB Plug Breakout <https://www.sparkfun.com/products/10031> SparkFun ESP8266 Thing <https://www.sparkfun.com/products/13231>; PROD_ID: CONN-11752
X2 = microbuilder:ESP-12E

## Net classes
0 default: width 0.203 mm, clearance 0.102 mm

## Board
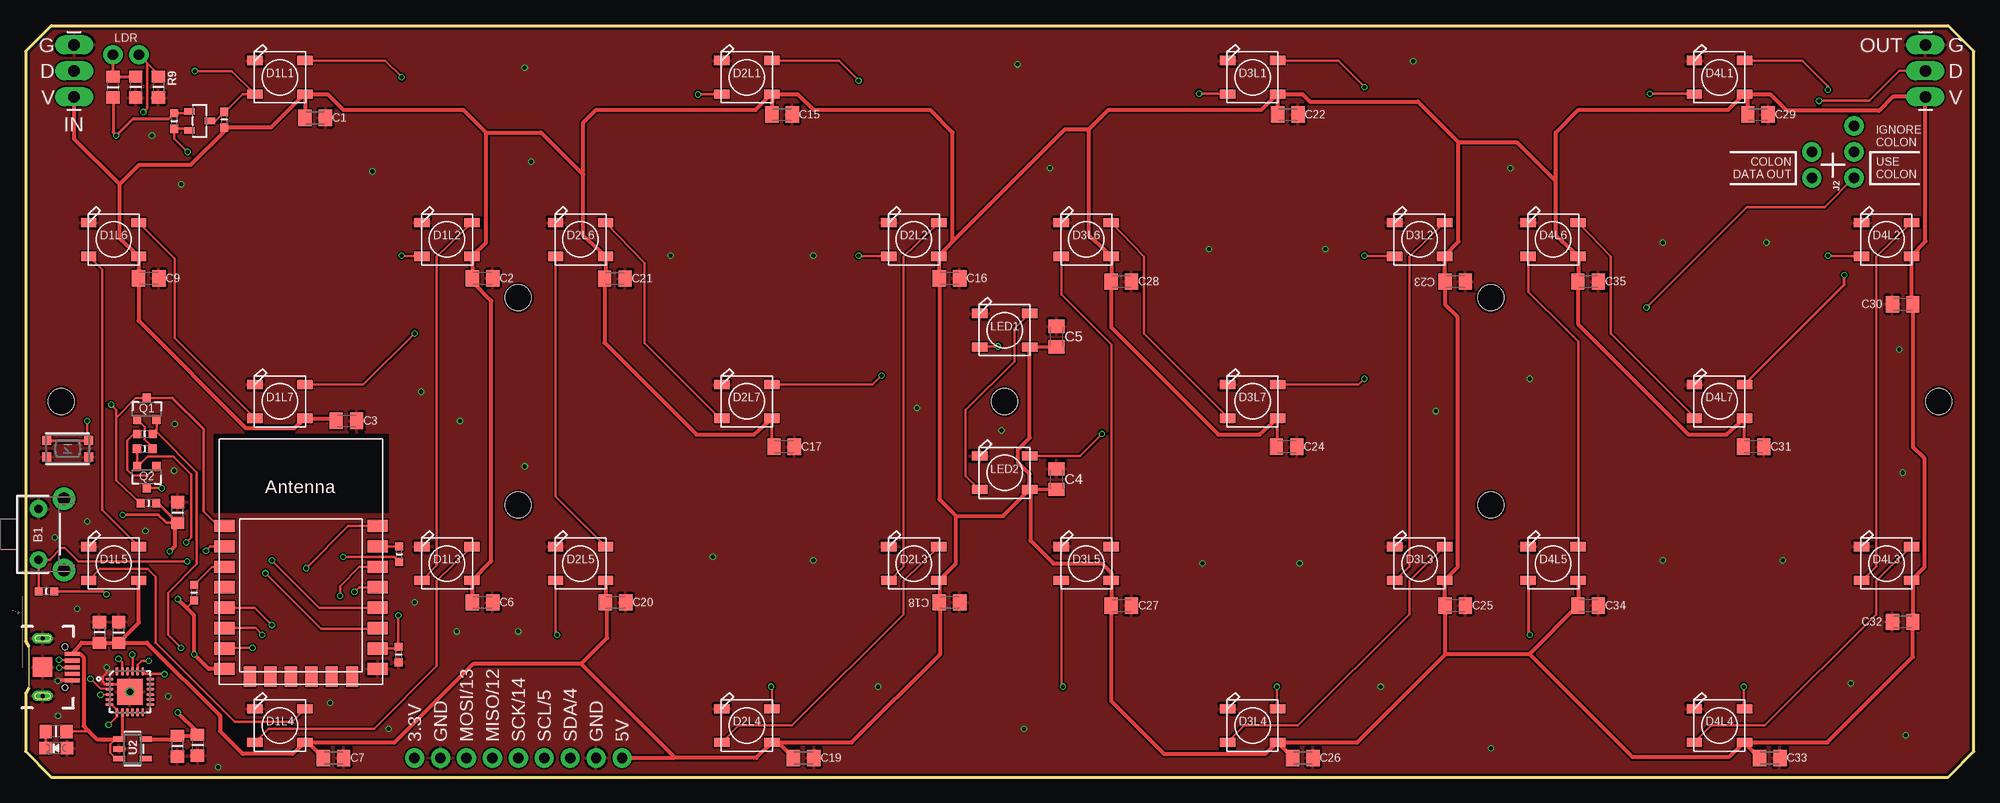
[diagram p2: board, top side]
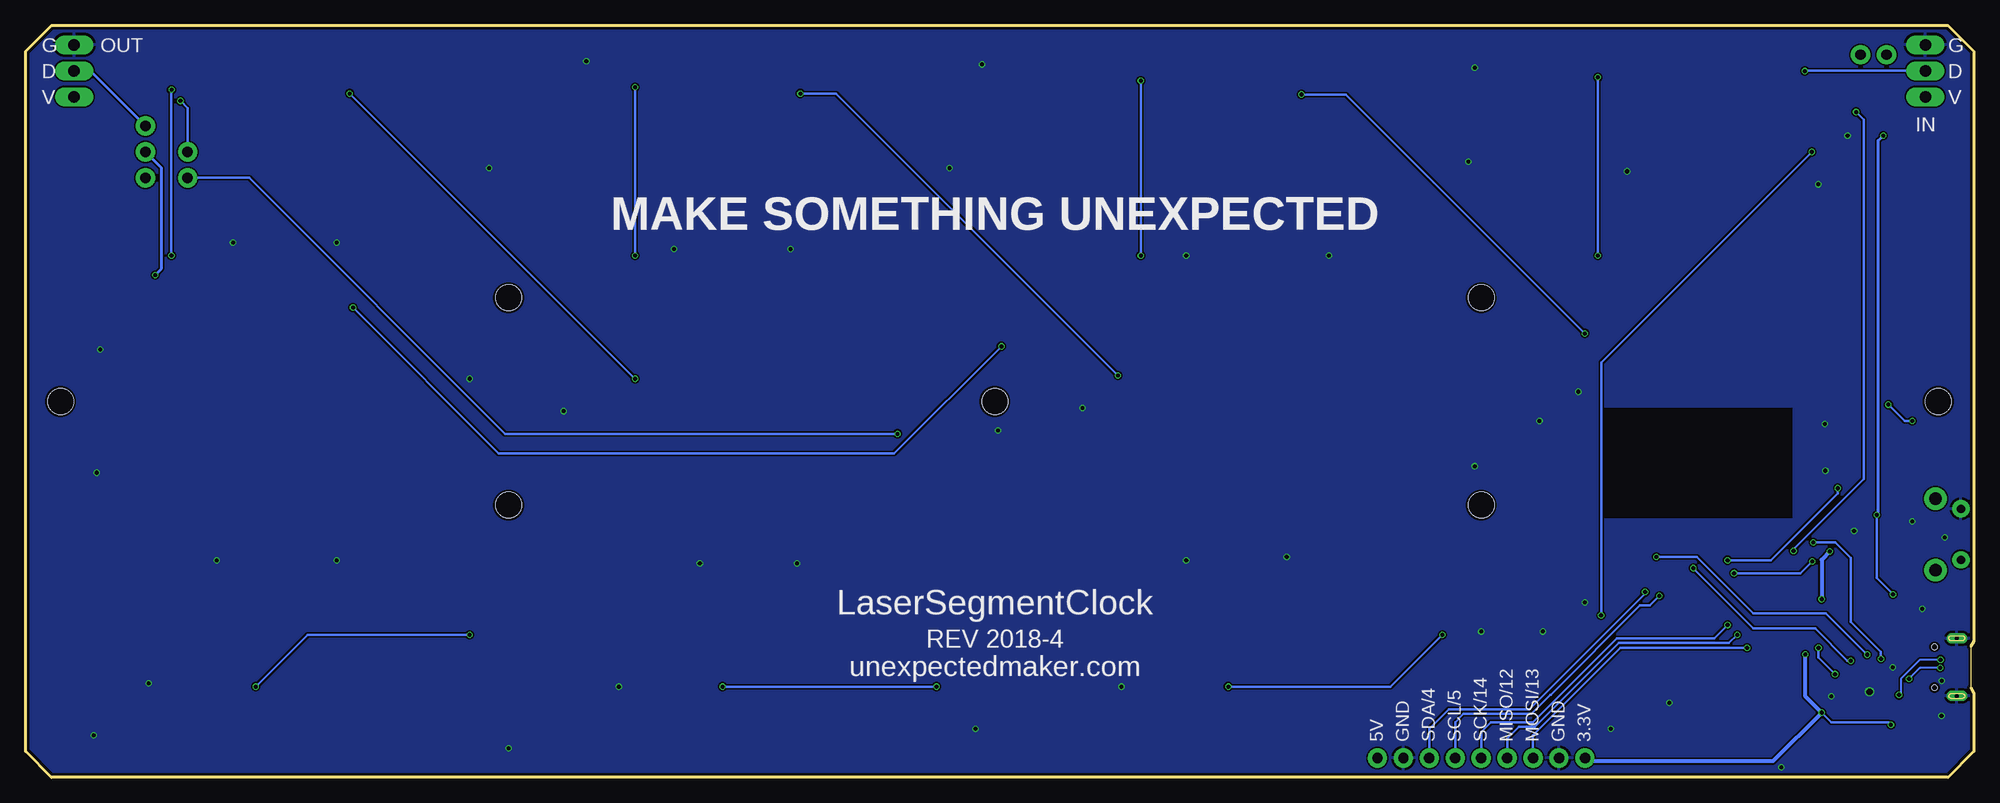
[diagram p3: board, bottom side, seen from below]

Size 190.82 x 73.66 mm. Coordinates in mm from the lower left corner, seen from the top.
Outline: 0,71.12 0,13.34 0.3,12.83 0.3,8.76 0,8.26 0,2.54 2.54,0 188.28,0 190.82,2.54 190.82,71.12 188.28,73.66 2.54,73.66 0,71.12
Copper layers (1*16): Top 0.035mm / dielectric 1.5mm / Bottom 0.035mm
Design rules "UnexpectedMaker_JLCPCB": minimum track width 6mil, minimum drill 10mil, track to track 6mil, track to pad 6mil, pad to pad 6mil, via to via 6mil, smd to smd 6mil, copper to edge 9mil, drill to drill 7mil, minimum pad ring 4mil, minimum via ring 4mil, stop-mask expansion 4mil, vias tented up to drill 25mil, thermal gap 10mil
Holes 2.54 mm at 3.49,36.83 48.26,26.67 95.88,36.83 143.51,26.67 187.39,36.83 48.26,46.99 143.51,46.99
tRestrict: area 18.4,25.9 to 35.6,33.7
bRestrict: area 17.8,25.4 to 36.2,36.2

### Footprints (pad centres in the part's own frame; a part is rotated, then mirrored left to right if it is on the bottom)
TACTILE_SWITCH_PTH_RIGHT_ANGLE_KIT = drill 0.8 pad 1.7: 1 -2.5,0; 2 2.5,0 | drill 1.2 pad 2.2: ANCHOR1 -3.5,2.5; ANCHOR2 3.5,2.5
C0805K = smd 1.3 x 1.6: 1 -1,0; 2 1,0
_0805MP = smd 1.2 x 1.3: 1 -1.016,0; 2 1.016,0
CHIPLED_0805_NOOUTLINE = smd 1.2 x 1.2: A 0,-1.05; C 0,1.05
WS2812B = smd 1.5 x 0.9: 1-VDD 2.45,-1.65; 2-DOUT 2.45,1.65; 3-GND -2.45,1.65; 4-DIN -2.45,-1.65
QFN24_4MM_SMSC = smd 0.8 x 0.28: 1 -2,1.25; 2 -2,0.75; 3 -2,0.25; 4 -2,-0.25; 5 -2,-0.75; 6 -2,-1.25; 13 2,-1.25; 14 2,-0.75; 15 2,-0.25; 16 2,0.25; 17 2,0.75; 18 2,1.25 | smd 0.28 x 0.8: 7 -1.25,-2; 8 -0.75,-2; 9 -0.25,-2; 10 0.25,-2; 11 0.75,-2; 12 1.25,-2; 19 1.25,2; 20 0.75,2; 21 0.25,2; 22 -0.25,2; 23 -0.75,2; 24 -1.25,2 | smd 2.5 x 2.5: THERM 0,0
1X03_LONGPADS = drill 1.118 pad 1.88 long: 1 0,0; 2 2.54,0; 3 5.08,0
1X09_NO_SILK = drill 1.016 pad 1.88: 1 0,0; 2 2.54,0; 3 5.08,0; 4 7.62,0; 5 10.16,0; 6 12.7,0; 7 15.24,0; 8 17.78,0; 9 20.32,0
1X03_NO_SILK = drill 1.016 pad 1.88: 1 0,0; 2 2.54,0; 3 5.08,0
1X02_NO_SILK = drill 1.016 pad 1.88: 1 0,0; 2 2.54,0
SOT23-3 = smd 0.8 x 0.9: 1 -0.95,-1; 2 0.95,-1; 3 0,1.1
SOT23-R = smd 0.635 x 1.016: 1 -0.95,-1; 2 0.95,-1; 3 0,1
_0603MP = smd 0.8 x 0.8: 1 -0.762,0; 2 0.762,0
BTN_KMR2_4.6X2.8 = smd 0.9 x 0.9: A 2.05,0.8; A' -2.05,0.8; B 2.05,-0.8; B' -2.05,-0.8
SOT23-5 = smd 0.55 x 1.2: 1 -0.95,-1.3; 2 0,-1.3; 3 0.95,-1.3; 4 0.95,1.3; 5 -0.95,1.3
USB-B-MICRO-SMD = smd 1.45 x 0.4: D+ 2.9,0; D- 2.9,0.65; GND 2.9,-1.3; ID 2.9,-0.65; VBUS 2.9,1.3 | drill 0.4 pad 1.016 long: P$1 0,2.825; P$2 0,-2.825 | smd 1.9 x 1.9: SHIELD3 0,0 | hole 0.55: 2.2,2; 2.2,-2
ESP-12E = smd 2 x 1.2: 1 -7.5,5.77; 2 -7.5,3.77; 3 -7.5,1.77; 4 -7.5,-0.23; 5 -7.5,-2.23; 6 -7.5,-4.23; 7 -7.5,-6.23; 8 -7.5,-8.23; 9 7.5,-8.23; 10 7.5,-6.23; 11 7.5,-4.23; 12 7.5,-2.23; 13 7.5,-0.23; 14 7.5,1.77; 15 7.5,3.77; 16 7.5,5.77 | smd 1.2 x 2: 17 -5,-9; 18 -3,-9; 19 -1,-9; 20 1,-9; 21 3,-9; 22 5,-9

### Placement (x,y rotation side)
B1  1.27,23.81 270 top
C1  28.37,64.62 0 top
C2  44.77,48.89 0 top
C3  31.43,34.92 0 top
C4  100.97,29.21 90 top
C5  100.97,43.18 90 top
C6  44.77,17.14 0 top
C7  30.16,1.91 0 top
C9  12.06,48.89 0 top
C10  9.13,14.2 90 top
C11  16.85,3.15 270 top
C12  14.87,3.06 270 top
C14  14.91,25.95 90 top
C15  74.09,64.94 0 top
C16  90.49,48.89 0 top
C17  74.29,32.38 0 top
C18  90.49,17.14 0 top
C19  76.2,1.91 0 top
C20  57.79,17.14 0 top
C21  57.71,48.87 0 top
C22  123.62,64.94 0 top
C23  140.02,48.58 0 top
C24  123.51,32.38 0 top
C25  140.02,16.83 0 top
C26  125.09,1.91 0 top
C27  107.31,16.83 0 top
C28  107.31,48.58 0 top
C29  169.66,64.94 0 top
C30  183.83,46.35 180 top
C31  169.23,32.38 0 top
C32  183.83,15.24 180 top
C33  170.81,1.91 0 top
C34  153.03,16.83 0 top
C35  153.03,48.58 0 top
D1  3.01,2.87 90 top
D1L1  24.92,68.58 0 top
D1L2  41.27,52.7 0 top
D1L3  41.27,20.95 0 top
D1L4  24.92,5.08 0 top
D1L5  8.64,20.95 0 top
D1L6  8.64,52.7 0 top
D1L7  24.92,36.83 0 top
D2L1  70.64,68.58 0 top
D2L2  87,52.7 0 top
D2L3  87,20.95 0 top
D2L4  70.64,5.08 0 top
D2L5  54.36,20.95 0 top
D2L6  54.36,52.7 0 top
D2L7  70.64,36.83 0 top
D3L1  120.17,68.58 0 top
D3L2  136.53,52.7 0 top
D3L3  136.53,20.95 0 top
D3L4  120.17,5.08 0 top
D3L5  103.89,20.95 0 top
D3L6  103.89,52.7 0 top
D3L7  120.17,36.83 0 top
D4L1  165.89,68.58 0 top
D4L2  182.25,52.7 0 top
D4L3  182.25,20.95 0 top
D4L4  165.89,5.08 0 top
D4L5  149.61,20.95 0 top
D4L6  149.61,52.7 0 top
D4L7  165.89,36.83 0 top
IC1  10.22,8.38 0 top
IN  4.76,66.67 90 top
J1  38.1,1.91 0 top
J2  179.07,58.74 90 top
J3  174.94,58.74 90 top
LDR  8.57,70.8 0 top
LED1  95.88,43.81 0 top
LED2  95.88,29.84 0 top
OUT  186.06,66.67 90 top
Q1  11.87,36.07 0 top
Q2  11.87,29.46 180 top
Q4  17.04,64.31 270 top
R1  14.57,64.3 90 top
R2  7.24,14.2 270 top
R3  16.51,18.1 270 top
R4  12.04,26.86 0 top
R5  11.67,32.21 0 top
R6  19.46,64.44 270 top
R7  11.68,33.66 180 top
R8  3,4.5 180 top
R9  13.02,67.63 270 top
R12  36.6,21.86 90 top
R13  10.8,67.63 270 top
R14  8.57,67.63 90 top
R15  2.04,18.24 180 top
SW2  4.13,32.19 180 top
U2  10.48,2.79 270 top
USB  1.68,10.79 0 top
V  36.54,12.03 270 top
X2  26.99,18.86 0 top

### Tracks (layer width: path | path; a pad name or v marks a point on that pad's centre or on a via)
3.3V  (via drill 0.4)
  Top 0.254: IC1.5 IC1.6 8.43,7.13 8.97,6.58 IC1.7 8.97,5.99 v8.13,5.14 | 13.02,26.86 R4.2 | R3.2 15.84,16.67 15.72,16.67 | R1.2 15.84,65.06 Q4.1 | R15.1 7.62,18.24 v7.92,17.93
  Top 0.305: v9.52,25.72 13.02,25.72 13.8,24.93 C14.1 13.02,26.82 13.02,26.86 | R14.1 8.57,63.18 v8.89,62.86 10.57,64.54 14.05,64.54 R1.2
  Top 0.406: v14.92,6.35 16.85,4.42 C11.1 16.76,4.08 C12.1 14.54,3.74 U2.5 | v14.92,17.46 15.72,16.67 16.51,15.88 v16.51,12.07 17.95,10.63 X2.8 | v14.11,22.12 14.63,22.64 14.63,24.65 C14.1
  Bottom 0.254: v14.92,6.35 13.97,5.4 8.38,5.4 v8.13,5.14 | v7.92,17.93 9.52,19.53 v9.52,25.72
  Bottom 0.305: v9.52,25.72 9.37,25.87 9.37,62.38 9.37,62.39 v8.89,62.86
  Bottom 0.406: v16.51,12.07 16.51,7.94 v14.92,6.35 19.68,1.59 37.78,1.59 J1.1 | v14.11,22.12 14.92,21.31 v14.92,17.46
ADC  (via drill 0.4)
  Top 0.254: X2.2 18.11,22.63 v17.67,22.19 | LDR.2 11.92,69.99 | 11.92,69.99 11.92,65.57 v11.54,65.19 | R9.1 13.02,68.9 11.92,69.99
  Bottom 0.254: v17.67,22.19 17.65,22.2 17.65,22.38 10.8,29.23 10.8,64.44 v11.54,65.19
CH_PD
  Top 0.254: X2.3 18.27,20.63 16.76,19.12 16.51,18.88 | 16.51,18.88 R3.1 16.51,18.88
COLON  (via drill 0.4)
  Top 0.254: v158.75,46.04 168.59,55.88 176.21,55.88 J2.1 | v95.25,42.23 93.5,42.23 LED1.4-DIN
  Bottom 0.254: v158.75,46.04 144.46,31.75 105.74,31.75 95.26,42.23 v95.25,42.23
D1_D2  (via drill 0.4)
  Top 0.254: D1L7.2-DOUT 33.08,38.48 v38.1,43.5 | D2L1.4-DIN 65.9,66.93 v65.88,66.9
  Bottom 0.254: v38.1,43.5 61.51,66.9 v65.88,66.9
D1DATA1  (via drill 0.4)
  Top 0.254: D1L1.2-DOUT 35.24,70.23 36.83,68.64 v36.83,68.58 | v36.83,51.12 36.89,51.05 D1L2.4-DIN
  Bottom 0.254: v36.83,68.58 v36.83,51.12
D1DATA2
  Top 0.254: D1L2.2-DOUT 40.27,51 40.27,21.27 40.27,20.75 D1L3.4-DIN
D1DATA3
  Top 0.254: D1L3.2-DOUT 40.27,19.26 40.27,10.91 34.13,4.76 23.81,4.76 22.48,3.43 D1L4.4-DIN
D1DATA4
  Top 0.254: D1L4.2-DOUT 26.1,5.46 20.46,5.46 12.75,13.18 12.75,19.64 11.98,20.4 7.28,20.4 D1L5.4-DIN
D1DATA5
  Top 0.254: D1L6.4-DIN 7.49,49.75 7.49,26.2 D1L5.2-DOUT
D1DATA6
  Top 0.254: D1L6.2-DOUT 14.6,50.84 14.6,43.04 D1L7.4-DIN
D2_D3  (via drill 0.4)
  Top 0.254: v83.82,39.37 82.93,38.48 D2L7.2-DOUT | v114.94,66.99 117.66,66.99 D3L1.4-DIN
  Bottom 0.254: v83.82,39.37 111.44,66.99 v114.94,66.99
D2DATA1  (via drill 0.4)
  Top 0.254: D2L1.2-DOUT 79.69,70.23 81.6,68.33 v81.6,68.26 | v81.6,51.12 81.66,51.05 D2L2.4-DIN
  Bottom 0.254: v81.6,68.26 v81.6,51.12
D2DATA2
  Top 0.254: D2L2.2-DOUT 85.99,51 85.99,20.65 84.65,19.3 D2L3.4-DIN
D2DATA3
  Top 0.254: D2L3.2-DOUT 85.99,19.26 85.99,15.99 75.09,5.08 69.85,5.08 68.2,3.43 D2L4.4-DIN
D2DATA4  (via drill 0.4)
  Top 0.254: D2L5.4-DIN 51.91,14.13 v52.07,13.97 | v73.03,8.89 73.09,8.83 D2L4.2-DOUT
  Bottom 0.254: v73.03,8.89 57.15,8.89 v52.07,13.97
D2DATA5
  Top 0.254: D2L6.4-DIN 51.91,27.5 D2L5.2-DOUT
D2DATA6
  Top 0.254: D2L6.2-DOUT 60.64,50.38 60.64,42.55 68.01,35.18 D2L7.4-DIN
D3_D4  (via drill 0.4)
  Top 0.254: v131.13,39.05 130.56,38.48 D3L7.2-DOUT | v159.07,66.99 163.38,66.99 D4L1.4-DIN
  Bottom 0.254: v131.13,39.05 v159.07,66.99
D3DATA1  (via drill 0.4)
  Top 0.254: D3L1.2-DOUT 128.59,70.23 131.13,67.69 v131.13,67.63 | v131.13,51.12 131.19,51.05 D3L2.4-DIN
  Bottom 0.254: v131.13,67.63 v131.13,51.12
D3DATA2
  Top 0.254: D3L2.2-DOUT 135.52,51 135.52,20.65 134.18,19.3 D3L3.4-DIN
D3DATA3
  Top 0.254: D3L3.2-DOUT 135.52,19.26 135.52,15.99 124.62,5.08 119.38,5.08 117.73,3.43 D3L4.4-DIN
D3DATA4  (via drill 0.4)
  Top 0.254: D3L5.4-DIN 101.44,9.05 v101.6,8.89 | v122.56,8.89 122.56,6.79 D3L4.2-DOUT
  Bottom 0.254: v101.6,8.89 v122.56,8.89
D3DATA5
  Top 0.254: D3L6.4-DIN 101.44,47.28 106.34,42.38 D3L5.2-DOUT
D3DATA6
  Top 0.254: D3L6.2-DOUT 109.54,51.04 109.54,43.5 117.72,35.32 D3L7.4-DIN
D4_D5  (via drill 0.4)
  Top 0.305: D4L7.2-DOUT 178.12,48.26 v178.12,49.21
  Bottom 0.305: J2.2 177.48,59.69 177.48,49.85 v178.12,49.21
D4DATA1  (via drill 0.4)
  Top 0.254: D4L1.2-DOUT 173.99,70.23 176.52,67.7 v176.52,67.36 | v176.53,51.12 176.59,51.05 D4L2.4-DIN
  Bottom 0.254: v176.53,51.12 176.53,67.35 v176.52,67.36
D4DATA2
  Top 0.254: D4L2.2-DOUT 181.24,51 181.24,20.65 179.9,19.3 D4L3.4-DIN
D4DATA3
  Top 0.254: D4L3.2-DOUT 181.24,19.26 181.24,15.99 170.34,5.08 165.1,5.08 163.45,3.43 D4L4.4-DIN
D4DATA4  (via drill 0.4)
  Top 0.254: v168.28,8.89 168.28,6.79 D4L4.2-DOUT
  Top 0.305: D4L5.4-DIN 147.16,13.97 v147.32,13.97
  Bottom 0.254: v147.32,13.97 163.19,13.97 v168.28,8.89
D4DATA5
  Top 0.254: 150.88,43.88 147.19,47.56 147.16,47.6 D4L6.4-DIN | 150.88,43.88 151.51,43.24 152.06,42.7 | D4L5.2-DOUT 152.06,42.7 | 152.06,42.7 150.88,43.88
D4DATA6
  Top 0.254: D4L6.2-DOUT 155.26,51.04 155.26,43.5 163.44,35.32 D4L7.4-DIN
D5DATA
  Top 0.254: LED1.2-DOUT 96.84,43.97 96.84,40.75 92.07,35.99 92.07,29.55 LED2.4-DIN
D+  (via drill 0.4)
  Top 0.203: USB.D+ 4.51,10.73 v3.31,10.73 | v6.36,9.67 7.37,8.66 8.2,8.66 IC1.3
  Bottom 0.203: v3.31,10.73 5.3,10.73 v6.36,9.67
D-  (via drill 0.4)
  Top 0.203: USB.D- 3.36,11.45 v3.28,11.53 | v7.34,8.08 7.39,8.13 IC1.4
  Bottom 0.203: v3.28,11.53 5.3,11.53 7.15,9.68 7.15,8.24 7.31,8.08 v7.34,8.08
DI_R  (via drill 0.4)
  Top 0.254: v16.56,69.2 18.74,69.2 20.2,69.2 D1L1.4-DIN 21.27,66.93 19.54,65.2 R6.1 18.57,64.31 Q4.3
  Bottom 0.254: IN.2 16.55,69.22 v16.56,69.2
DTR  (via drill 0.4)
  Top 0.254: R5.1 10.91,32.23 10.92,32.25 Q2.2 10.97,30.46 11.95,31.45 14.48,31.45 16.24,29.68 16.24,23.52 v15.74,23.02 | IC1.23 9.46,10.39 9.46,11.27 v9.1,11.63
  Bottom 0.254: v9.1,11.63 9.1,12.28 12.06,15.24 12.06,21.5 13.58,23.02 v15.74,23.02
EXTEND  (via drill 0.4)
  Top 0.254: OUT.2 183.5,69.22 180.56,66.28 v175.64,66.28
  Bottom 0.254: v175.64,66.28 174.94,65.58 J3.2
  Bottom 0.305: J2.3 184.44,69.19 186.03,69.19 OUT.2
EXTEND_START  (via drill 0.4)
  Top 0.254: LED2.2-DOUT 103.25,31.49 v105.41,33.66
  Bottom 0.254: v105.41,33.66 143.83,33.66 168.91,58.74 J3.1
GND  (via drill 0.4, 0.6)
  Top 0.254: IC1.THERM 9.97,8.64 9.97,9.13 IC1.2 7.82,9.14 7.54,9.42 7.54,9.85 7.94,10.24 v7.94,10.79
  Top 0.406: USB.GND 3.21,9.5 v3.16,9.45
  other vias: 29.84,7.3 38.73,37.78 13.97,7.94 42.23,14.29 15.24,58.1 48.26,14.29 33.97,59.37 42.54,34.92 67.31,21.59 83.5,8.89 48.9,30.48 77.15,21.27 63.18,51.12 97.79,4.76 77.15,51.12 87.31,36.2 115.25,20.95 132.72,8.89 97.16,69.85 143.51,2.86 115.89,51.75 124.78,20.95 127.32,51.75 138.11,35.88 172.09,21.27 178.75,9.21 135.89,70.17 184.15,4.13 160.34,52.39 170.5,52.39 183.52,41.91 95.57,33.97 100.33,59.69 48.9,69.53 183.83,29.84 160.34,21.27 145.41,59.69 49.53,60.32 147.32,39.05 12.38,62.86 10.22,8.38 11.75,24.13 6.03,25.08 14.6,34.61 14.54,30.05 38.1,17.14 35.56,4.76 18.86,1 3.17,6.03 5.08,16.51 2.86,23.49
  pour Top: -2.22,76.2 -2.22,-2.54 191.45,-2.54 191.45,76.2
  pour Bottom: -3.18,77.47 192.09,77.47 192.09,-5.08 -3.18,-5.08
GPIO0  (via drill 0.4)
  Top 0.254: Q2.3 12.43,28.36 12.46,28.33 v13.34,28.33 | X2.12 32.38,16.63 28.77,16.63 v24.13,21.27
  Bottom 0.254: v24.13,21.27 19.9,21.27 13.34,27.84 v13.34,28.33
GPIO2  (via drill 0.4)
  Top 0.254: X2.11 34.57,14.54 28.96,14.54 v23.49,20 | v15.84,21.15 5.16,21.15 3.83,22.47 3.52,22.47 2.36,21.31 B1.2 1.27,18.41 R15.2
  Bottom 0.254: v15.84,21.15 16.98,20 v23.49,20
GPIO4/SDA  (via drill 0.4)
  Top 0.254: X2.13 32.68,18.63 v32.21,18.16
  Bottom 0.254: v32.21,18.16 32.21,18.01 43.55,6.67 51.43,6.67 53.34,4.76 J1.7
GPIO5/SCL  (via drill 0.4)
  Top 0.254: X2.14 32.69,20.63 30.8,18.73 v30.8,17.78
  Bottom 0.254: J1.6 50.8,5.4 49.99,6.21 43.36,6.21 41.48,8.1 41.43,8.1 32.7,16.83 31.75,16.83 v30.8,17.78
GPIO12/MISO  (via drill 0.4)
  Top 0.254: X2.6 22.52,14.63 v23.18,13.97
  Bottom 0.254: v23.18,13.97 23.99,13.16 28.45,13.16 34.8,13.16 43.01,4.94 44.59,4.94 45.72,3.81 J1.4
GPIO13/MOSI  (via drill 0.4)
  Top 0.254: X2.7 19.56,12.7 v22.23,12.7
  Bottom 0.254: v22.23,12.7 27.94,12.7 34.29,12.7 34.61,12.7 43.18,4.13 J1.3
GPIO14/SCK  (via drill 0.4)
  Top 0.254: X2.5 22.42,16.63 v24.13,14.92
  Bottom 0.254: v24.13,14.92 25.44,13.61 34.99,13.61 43.2,5.4 47.31,5.4 48.26,4.44 J1.5
GPIO15  (via drill 0.4)
  Top 0.254: 36.38,12.63 X2.10 36.38,12.63 | Q4.2 15.87,63.54 R1.1 14.57,62.59 v15.88,61.28 | v36.51,15.88 36.51,12.81 V.1 36.38,12.63
  Bottom 0.254: v15.88,61.28 36.51,40.64 v36.51,15.88
LDR
  Top 0.305: R13.1 R14.2 LDR.1
N$2
  Top 0.254: R8.2 1.98,2.89 D1.C
N$12
  Top 0.254: Q1.1 11.68,34.31 11.68,33.11 12.43,32.36 R5.2
N$13
  Top 0.254: Q2.1 11.95,29.59 10.48,29.59 9.97,30.1 9.97,33.02 10.6,33.66 R7.2
RESET  (via drill 0.4)
  Top 0.254: 14.39,37.17 Q1.3 10.82,37.17 8.88,35.23 | R4.1 8.88,29.1 8.88,32.07 | 8.88,35.23 8.88,32.07 | 17.44,34.12 17.44,26.04 18.85,24.63 X2.1 | 8.88,32.07 | 8.88,35.23 8.88,36.01 v8.38,36.51 | v6.03,34.92 6.03,33.14 SW2.B'
  Top 0.305: 17.44,34.12 14.39,37.17 | SW2.B SW2.B'
  Bottom 0.254: v8.38,36.51 6.79,34.92 v6.03,34.92
RTS  (via drill 0.4)
  Top 0.254: IC1.19 11.7,10.16 12.7,10.16 13.56,10.16 v13.61,10.12 | Q1.2 12.82,34.1 12.45,33.72 R7.1 12.84,33.81 16.76,29.9 16.76,20.89 13.97,18.1 13.97,13.95 15.22,12.7 v15.22,12.68
  Bottom 0.254: v13.61,10.12 13.61,10.16 15.22,11.77 v15.22,12.68
RXD
  Top 0.254: X2.15 35.77,22.63 R12.2
TXD  (via drill 0.4)
  Top 0.254: IC1.20 10.97,11.04 11.37,11.43 v12.06,11.43 | X2.16 34.29,24.63 31.62,24.63 v27.48,20.5
  Bottom 0.254: v12.06,11.43 12.38,11.43 15.56,14.61 21.59,14.61 v27.48,20.5
USB_RX  (via drill 0.4)
  Top 0.254: v10.46,12.03 v10.47,12.02 IC1.21 | R12.1 36.11,21.59 v31.12,21.59
  Bottom 0.254: v10.46,12.03 14.49,16.05 21.59,16.05 27.13,21.59 v31.12,21.59
VBUS
  Top 0.254: 6.16,4.57 6.08,4.5 R8.1 | 8.79,3.71 8.3,3.22 8.3,2.4 8.86,1.84 U2.3
  Top 0.305: D2L1.1-VDD 73.03,66.93 | 56.96,17.27 56.84,17.14 C20.1 | C15.1 | C17.1 73.09,32.43 D2L7.1-VDD | D3L1.1-VDD 122.56,66.93 | C24.1 122.62,32.94 D3L7.1-VDD | D4L1.1-VDD 168.28,66.93 | C31.1 168.34,32.94 D4L7.1-VDD | 39.71,65.41 39.73,65.39 | D1L1.1-VDD 27.3,66.93 | 27.37,64.63 C1.1 | IC1.8 9.47,4.04 U2.1
  Top 0.406: U2.1 9.14,3.71 8.79,3.71 7.02,3.71 6.16,4.57 5.68,5.05 5.68,11.77 5.35,12.1 USB.VBUS 4.79,12.36 | 39.71,65.41 31.12,65.41 29.59,66.93 D1L1.1-VDD 27.37,64.63 | 90.81,52.52 D2L2.1-VDD 89.44,48.94 C16.1 89.49,27.24 91.12,25.6 | 90.81,52.52 90.81,63.18 88.58,65.41 77.15,65.41 75.63,66.93 D2L1.1-VDD C15.1 | 73.03,66.93 71.5,65.41 55.88,65.41 54.61,64.14 54.61,59.05 | D2L7.1-VDD 71.33,33.59 65.71,33.59 56.71,42.59 C21.1 56.81,48.97 D2L6.1-VDD 54.61,53.09 54.61,59.05 | 140.34,62.23 140.34,52.52 D3L2.1-VDD 138.97,48.62 C23.1 139.02,46.33 140.22,45.13 140.22,20.55 D3L3.1-VDD 138.97,16.87 C25.1 139.02,12.11 139.06,12.07 | 122.56,66.93 121.03,65.41 106.05,65.41 104.14,63.5 | D3L4.1-VDD 121.41,2.3 111.49,2.3 106.31,7.48 C27.1 106.34,16.85 D3L5.1-VDD 106.34,20.03 105.41,20.95 100.65,20.95 98.4,23.2 98.4,28.26 | D3L7.1-VDD 120.86,33.59 116.82,33.59 106.31,44.1 C28.1 106.34,48.6 D3L6.1-VDD 104.14,53.09 104.14,63.5 | 139.06,12.07 130.43,3.43 D3L4.1-VDD | 168.28,66.93 166.75,65.41 152.08,65.41 149.86,63.18 149.86,58.42 | D4L7.1-VDD 166.58,33.59 162.86,33.59 152.03,44.41 C35.1 152.06,48.6 D4L6.1-VDD 149.86,53.09 149.86,58.42 | 45.09,63.18 42.86,65.41 39.74,65.41 39.73,65.39 | 91.12,25.6 91.12,20.98 D2L3.1-VDD 89.49,19.26 C18.1 89.53,17.1 89.53,12.07 80.9,3.43 D2L4.1-VDD | LED2.1-VDD 98.4,28.26 | 98.4,28.26 C4.1 | LED2.1-VDD 98.34,29.72 97.18,30.88 97.18,32.11 98.34,33.27 LED1.1-VDD 98.4,42.23 C5.1 | 27.3,66.93 24.05,63.68 R6.2 19.46,63.27 16.19,60.01 11.11,60.01 9.21,58.1 | D1L4.1-VDD 26.16,2.3 21.27,2.3 19.05,4.52 19.05,6.03 11.89,13.19 9.14,13.19 C10.1
  Top 0.406: 9.21,58.1 9.21,52.79 D1L6.1-VDD 11.09,48.92 C9.1 11.06,44.73 21.57,34.22 26.31,34.22 D1L7.1-VDD 30.18,35.18 C3.1 | 45.09,63.18 45.09,52.41 D1L2.1-VDD C2.1 43.77,48.51 45.61,46.67 45.61,21.19 D1L3.1-VDD 43.73,17.19 C6.1 | C10.1 9.21,13.19 9.2,13.18 R2.2 5.5,13.19 4.79,12.36 | 147.32,12.07 157.4,1.98 166.79,1.98 D4L4.1-VDD 168.59,3.43 | 54.42,11.11 63.55,1.98 63.48,1.91 | J1.9 63.48,1.91 | LED2.1-VDD 95.74,25.6 91.12,25.6 | 45.09,63.18 50.48,63.18 54.61,59.05 | 140.34,62.23 136.36,66.2 125.8,66.2 125.07,66.93 D3L1.1-VDD C22.1 | 140.34,62.23 146.05,62.23 149.86,58.42 | 147.32,12.07 139.06,12.07 | 90.81,52.52 101.79,63.5 104.14,63.5 | 54.42,11.11 43.82,11.11 36.13,3.43 D1L4.1-VDD | D2L4.1-VDD 71.56,1.91 63.48,1.91 | D1L5.1-VDD 11.1,19.29 11.1,15.15 C10.1 | C29.1 168.66,66.61 D4L1.1-VDD 170.88,66.93 172.49,65.32 181.52,65.32 182.88,66.67 OUT.1 186.06,52.52 D4L2.1-VDD 184.69,46.49 C30.1 184.83,32.38 185.94,31.28 185.94,20.55 D4L3.1-VDD 184.83,19.17 C32.1 184.83,11.79 176.47,3.43 168.59,3.43 | C33.1 168.59,3.13 168.59,3.43 | D3L4.1-VDD 124.09,1.95 C26.1 | D2L4.1-VDD 73.68,3.43 C19.1 | D1L4.1-VDD 27.64,3.43 C7.1 | D2L5.1-VDD 56.81,17.18 56.84,17.14 | 54.42,11.11 56.96,13.65 56.96,17.27 | D4L5.1-VDD 152.06,16.85 C34.1 147.32,12.11 147.32,12.07 | 9.21,58.1 4.76,62.55 IN.1 | USB.VBUS 4.58,12.14 4.79,12.36

### Text on the board
tPlace: G | G | D | D | V | V | IGNORE / COLON | COLON / DATA OUT | USE / COLON | 3.3V | GND | MOSI/13 | MISO/12 | SCK/14 | SCL/5 | SDA/4 | GND | 5V
bPlace: G | OUT | G | D | D | V | V | IN | MAKE SOMETHING UNEXPECTED | LaserSegmentClock | REV 2018-4 | unexpectedmaker.com | 3.3V | GND | MOSI/13 | MISO/12 | SCK/14 | SCL/5 | SDA/4 | GND | 5V